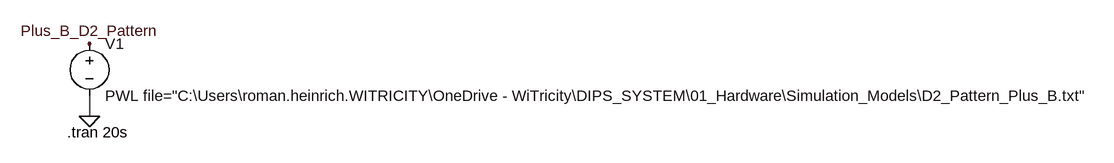
[diagram p0: schematic Power_Fluctuation_Pattern_Sim.asc]
Power_Fluctuation_Pattern_Sim.asc, the LTspice schematic file:
Version 4
SHEET 1 1896 680
WIRE 192 256 192 224
FLAG 192 256 0
FLAG 192 144 Plus_B_D2_Pattern
SYMBOL voltage 192 128 R0
WINDOW 123 0 0 Left 0
WINDOW 39 0 0 Left 0
SYMATTR InstName V1
SYMATTR Value PWL file="C:\Users\roman.heinrich.WITRICITY\OneDrive - WiTricity\DIPS_SYSTEM\01_Hardware\Simulation_Models\D2_Pattern_Plus_B.txt"
TEXT 158 280 Left 2 !.tran 20s

The netlist it stands for:
* Power_Fluctuation_Pattern_Sim.asc
V1 Plus_B_D2_Pattern 0 PWL file="C:\Users\roman.heinrich.WITRICITY\OneDrive - WiTricity\DIPS_SYSTEM\01_Hardware\Simulation_Models\D2_Pattern_Plus_B.txt"
.tran 20s
.backanno
.end